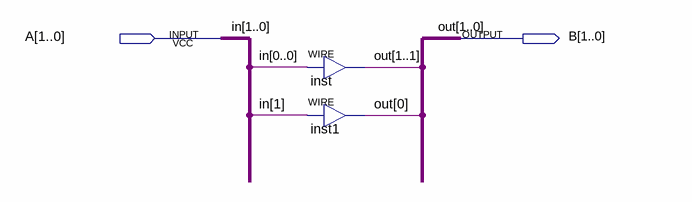
[diagram p0: schematic sheet]
// Quartus schematic shifter_2b.bdf as structural Verilog: 2 symbols, 2 pins
module shifter_2b (
  input  [1:0] A,
  output [1:0] B
);

  assign B[1] = A[0];  // WIRE inst
  assign B[0] = A[1];  // WIRE inst1

  // Other names for the same wires on the sheet: in[1:0] = A; out[1:0] = B
endmodule
